# EAGLE board io2 (EAGLE 6.6.0)
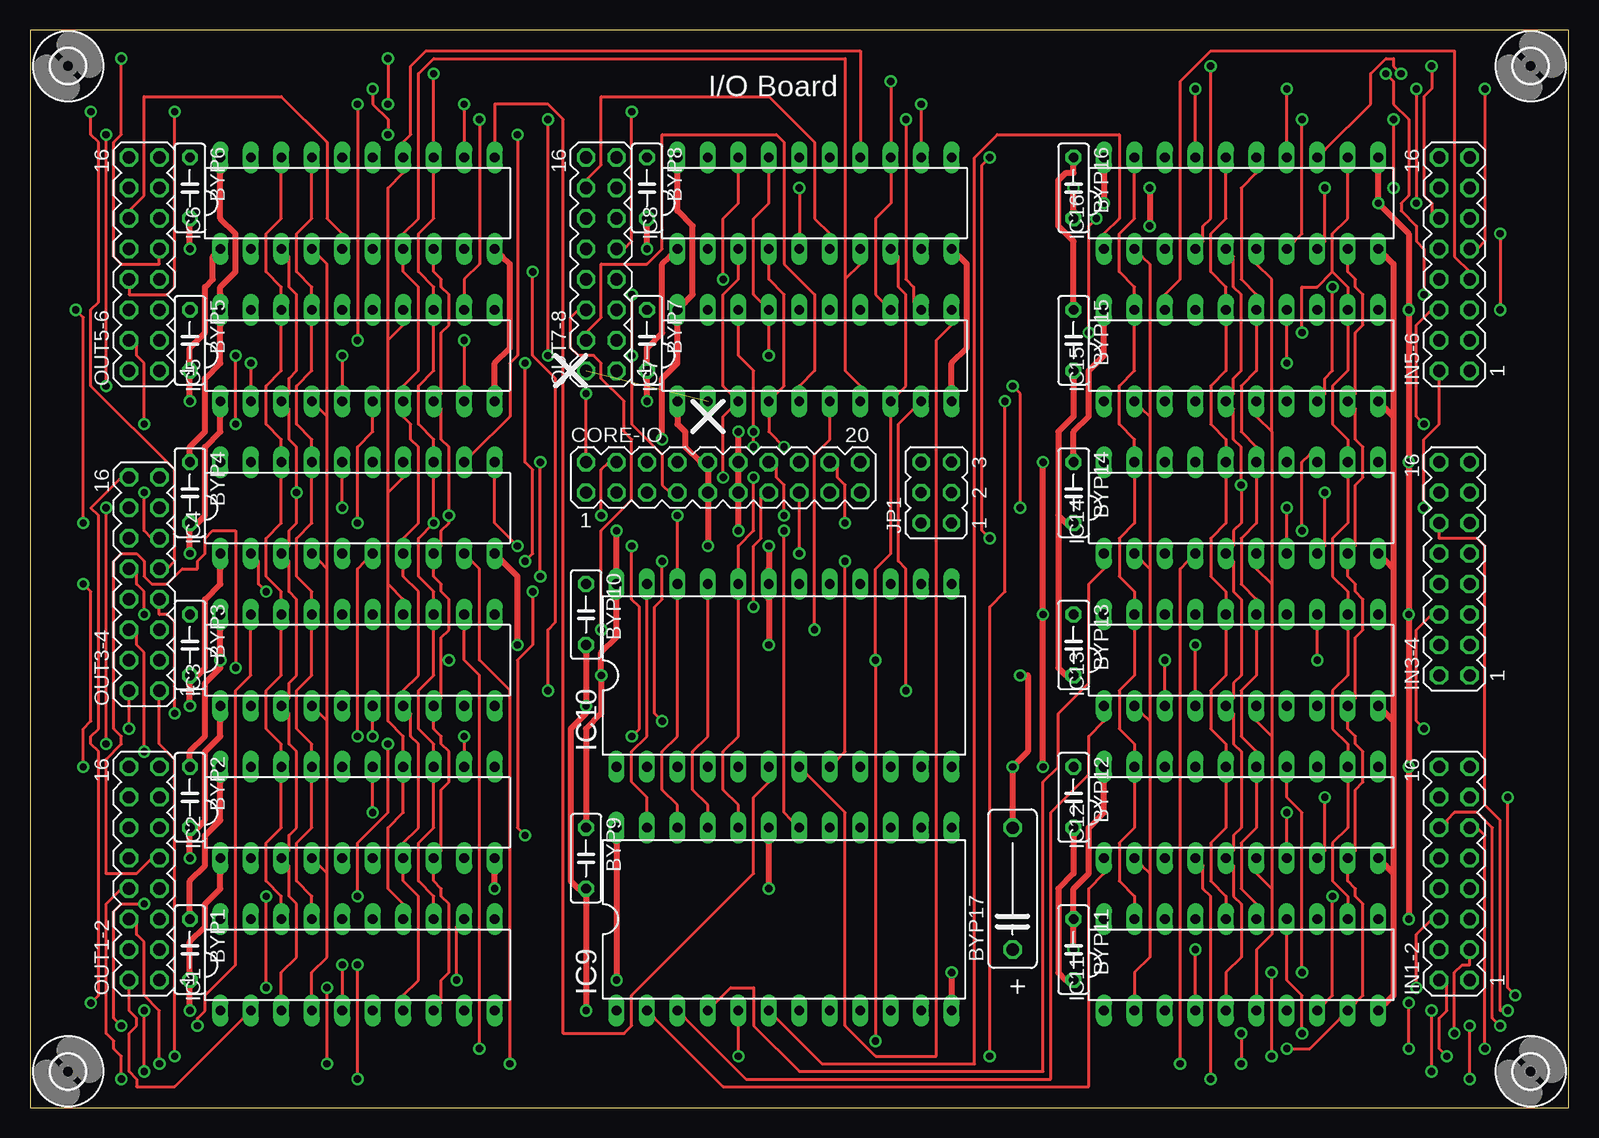
[diagram p2: board, top side]
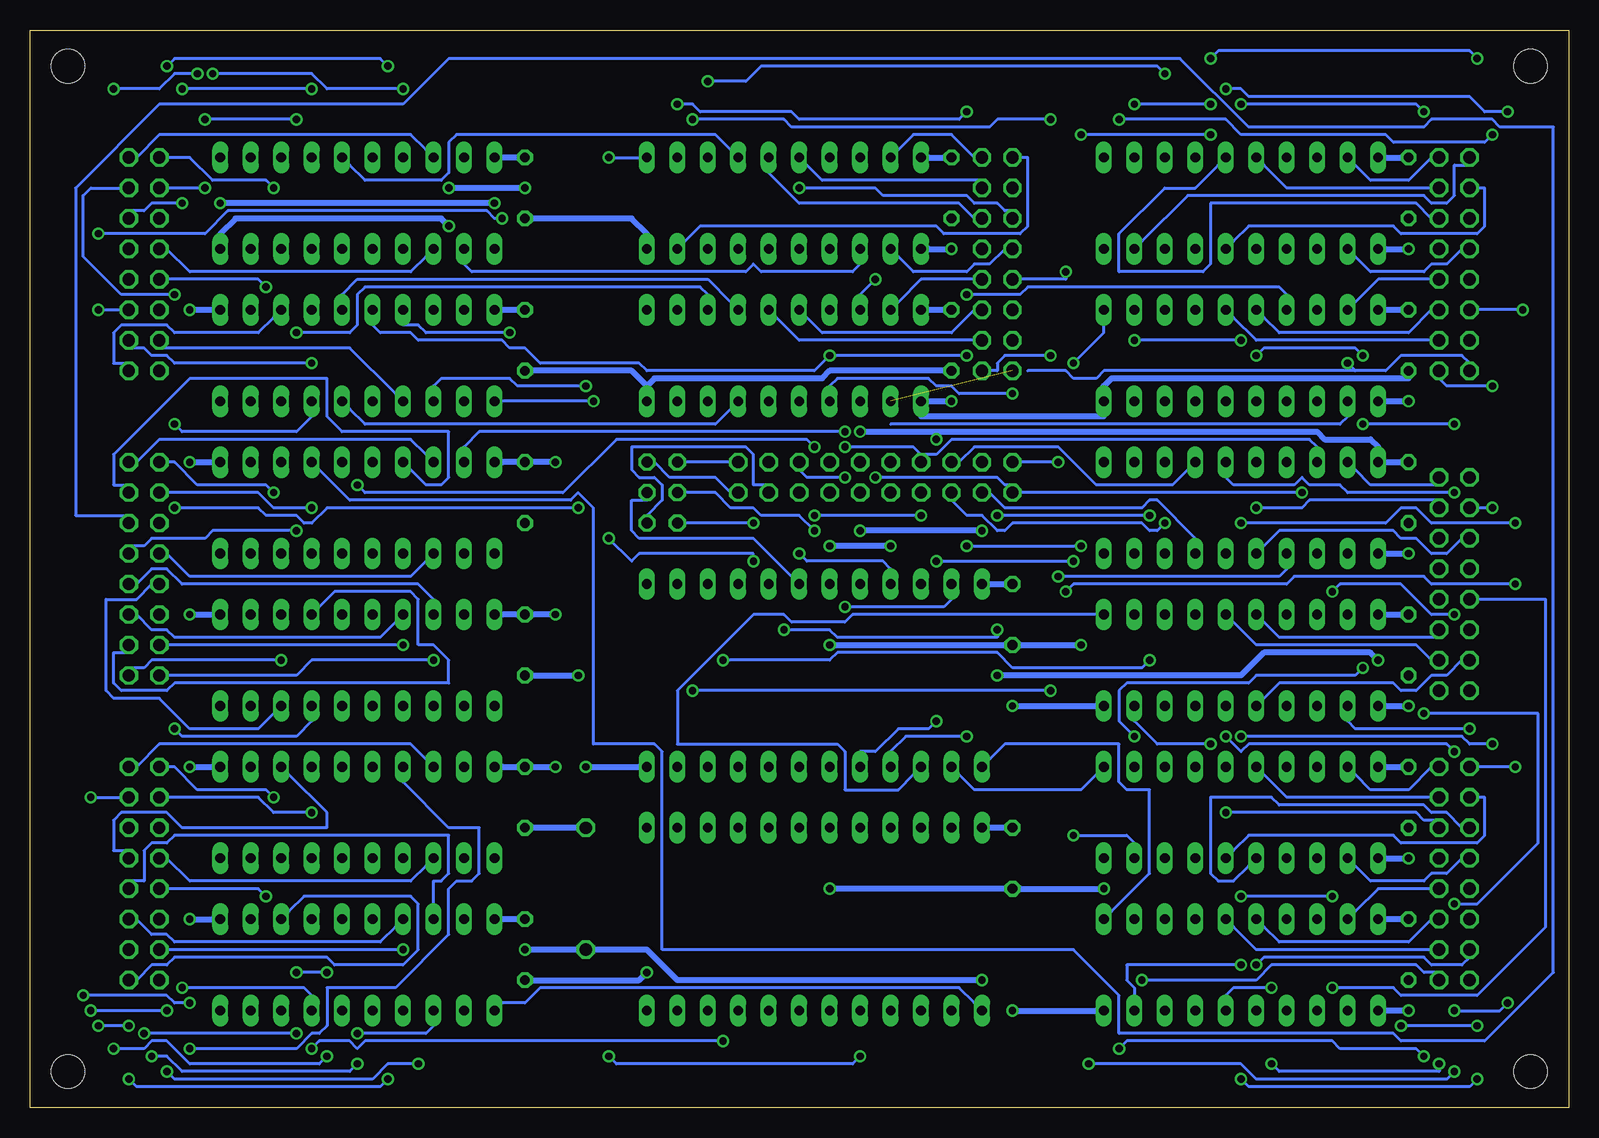
[diagram p3: board, bottom side, seen from below]

Size 128.25 x 89.84 mm. Coordinates in mm from the lower left corner, seen from the top.
Outline: 0,0 128.25,0 128.25,89.84 0,89.84 0,0
Copper layers (1*16): Top 0.035mm / dielectric 1.5mm / Bottom 0.035mm
Design rules "default": minimum track width 10mil, minimum drill 24mil, track to track 8mil, track to pad 8mil, pad to pad 8mil, via to via 8mil, smd to smd 8mil, copper to edge 40mil, drill to drill 8mil, minimum pad ring 10mil, minimum via ring 8mil, stop-mask expansion 4mil, vias tented up to drill 0mil, thermal gap 10mil
Net classes: 1 Power: width 0.508 mm, drill 0.254 mm, clearance 0.254 mm

## Footprints (pad centres in the part's own frame; a part is rotated, then mirrored left to right if it is on the bottom)
C050-025X075 = drill 0.813 octagon: 1 -2.54,0; 2 2.54,0
C102-043X133 = drill 1.016 octagon: 1 -5.08,0; 2 5.08,0
MA10-2 = drill 1.016 octagon: 1 -11.43,-1.27; 2 -11.43,1.27; 3 -8.89,-1.27; 4 -8.89,1.27; 5 -6.35,-1.27; 6 -6.35,1.27; 7 -3.81,-1.27; 8 -3.81,1.27; 9 -1.27,-1.27; 10 -1.27,1.27; 11 1.27,-1.27; 12 1.27,1.27; 13 3.81,-1.27; 14 3.81,1.27; 15 6.35,-1.27; 16 6.35,1.27; 17 8.89,-1.27; 18 8.89,1.27; 19 11.43,-1.27; 20 11.43,1.27
DIL20 = drill 0.813 long: 1 -11.43,-3.81; 2 -8.89,-3.81; 3 -6.35,-3.81; 4 -3.81,-3.81; 5 -1.27,-3.81; 6 1.27,-3.81; 7 3.81,-3.81; 8 6.35,-3.81; 9 8.89,-3.81; 10 11.43,-3.81; 11 11.43,3.81; 12 8.89,3.81; 13 6.35,3.81; 14 3.81,3.81; 15 1.27,3.81; 16 -1.27,3.81; 17 -3.81,3.81; 18 -6.35,3.81; 19 -8.89,3.81; 20 -11.43,3.81
DIL24-6 = drill 0.813 long: 1 -13.97,-7.62; 2 -11.43,-7.62; 3 -8.89,-7.62; 4 -6.35,-7.62; 5 -3.81,-7.62; 6 -1.27,-7.62; 7 1.27,-7.62; 8 3.81,-7.62; 9 6.35,-7.62; 10 8.89,-7.62; 11 11.43,-7.62; 12 13.97,-7.62; 13 13.97,7.62; 14 11.43,7.62; 15 8.89,7.62; 16 6.35,7.62; 17 3.81,7.62; 18 1.27,7.62; 19 -1.27,7.62; 20 -3.81,7.62; 21 -6.35,7.62; 22 -8.89,7.62; 23 -11.43,7.62; 24 -13.97,7.62
MA08-2 = drill 1.016 octagon: 1 -8.89,-1.27; 2 -8.89,1.27; 3 -6.35,-1.27; 4 -6.35,1.27; 5 -3.81,-1.27; 6 -3.81,1.27; 7 -1.27,-1.27; 8 -1.27,1.27; 9 1.27,-1.27; 10 1.27,1.27; 11 3.81,-1.27; 12 3.81,1.27; 13 6.35,-1.27; 14 6.35,1.27; 15 8.89,-1.27; 16 8.89,1.27
JP3Q = drill 0.914 octagon: 1 -2.54,-1.27; 2 -2.54,1.27; 3 0,-1.27; 4 0,1.27; 5 2.54,-1.27; 6 2.54,1.27
2,8 = hole 2.8: 0,0

## Placement (x,y rotation side)
BYP1  .01uf  [C050-025X075]  13.33,13.17 270 top
BYP2  .01uf  [C050-025X075]  13.33,25.87 270 top
BYP3  .01uf  [C050-025X075]  13.33,38.57 270 top
BYP4  .01uf  [C050-025X075]  13.33,51.27 270 top
BYP5  .01uf  [C050-025X075]  13.33,63.97 270 top
BYP6  .01uf  [C050-025X075]  13.33,76.67 270 top
BYP7  .01uf  [C050-025X075]  51.43,63.97 270 top
BYP8  .01uf  [C050-025X075]  51.43,76.67 270 top
BYP9  .01uf  [C050-025X075]  46.35,20.79 270 top
BYP10  .01uf  [C050-025X075]  46.35,41.11 270 top
BYP11  .01uf  [C050-025X075]  86.99,13.17 270 top
BYP12  .01uf  [C050-025X075]  86.99,25.87 270 top
BYP13  .01uf  [C050-025X075]  86.99,38.57 270 top
BYP14  .01uf  [C050-025X075]  86.99,51.27 270 top
BYP15  .01uf  [C050-025X075]  86.99,63.97 270 top
BYP16  .01uf  [C050-025X075]  86.99,76.67 270 top
BYP17  100uf 25V  [C102-043X133]  81.91,18.25 90 top
CORE-IO  [MA10-2]  57.78,52.54 0 top
IC1  74LS374N  [DIL20]  27.3,11.9 0 top
IC2  74LS374N  [DIL20]  27.3,24.6 0 top
IC3  74LS374N  [DIL20]  27.3,37.3 0 top
IC4  74LS374N  [DIL20]  27.3,50 0 top
IC5  74LS374N  [DIL20]  27.3,62.7 0 top
IC6  74LS374N  [DIL20]  27.3,75.4 0 top
IC7  74LS374N  [DIL20]  65.4,62.7 0 top
IC8  74LS374N  [DIL20]  65.4,75.4 0 top
IC9  74154N  [DIL24-6]  62.86,15.71 0 top
IC10  74154N  [DIL24-6]  62.86,36.03 0 top
IC11  74LS373N  [DIL20]  100.96,11.9 0 top
IC12  74LS373N  [DIL20]  100.96,24.6 0 top
IC13  74LS373N  [DIL20]  100.96,37.3 0 top
IC14  74LS373N  [DIL20]  100.96,50 0 top
IC15  74LS373N  [DIL20]  100.96,62.7 0 top
IC16  74LS373N  [DIL20]  100.96,75.4 0 top
IN1-2  [MA08-2]  118.74,19.52 90 top
IN3-4  [MA08-2]  118.74,44.92 90 top
IN5-6  [MA08-2]  118.74,70.32 90 top
JP1  [JP3Q]  75.56,51.27 90 top
OUT1-2  [MA08-2]  9.52,19.52 90 top
OUT3-4  [MA08-2]  9.52,43.65 90 top
OUT5-6  [MA08-2]  9.52,70.32 90 top
OUT7-8  [MA08-2]  47.62,70.32 90 top
U$1  [2,8]  125.09,3.01 0 top
U$2  [2,8]  125.09,86.83 0 top
U$3  [2,8]  3.17,86.83 0 top
U$4  [2,8]  3.17,3.01 0 top

## Tracks (layer width: path | path; a pad name or v marks a point on that pad's centre or on a via)
GND  (via drill 0.61)
  Top 0.508: 113.66,19.52 113.66,9.36 113.02,8.73 IC11.10 | 113.66,19.52 113.02,20.15 IC12.10 | 113.66,32.22 113.02,32.85 IC13.10 | 113.66,32.22 113.66,19.52 | 113.66,44.92 113.02,45.55 IC14.10 | 113.66,44.92 113.66,32.22 | 113.66,57.62 113.02,58.25 IC15.10 | 113.66,57.62 113.66,44.92 | 113.66,57.62 113.66,70.32 113.02,70.95 IC16.10 | 85.72,49.37 86.35,48.73 BYP14.2 | 85.72,49.37 85.72,56.35 86.99,57.62 86.99,60.8 BYP15.2 | IC8.10 77.46,70.95 78.1,70.32 78.1,63.34 76.83,62.06 76.83,60.16 IC7.10 | v76.83,11.27 76.83,9.36 IC9.12 | BYP17.2 81.91,23.96 v81.91,28.41 83.18,29.68 83.18,36.03 v82.55,36.03 | BYP11.2 86.35,10.63 85.72,11.27 85.72,18.25 86.99,19.52 86.99,22.7 BYP12.2 | 85.72,49.37 85.72,36.66 86.35,36.03 BYP13.2 | v93.34,76.67 v93.34,73.5 | v86.99,76.67 86.99,74.77 BYP16.2 | v13.33,8.09 13.33,10 BYP1.2 13.33,11.27 13.33,13.81 14.6,15.08 14.6,16.98 15.87,18.25 15.87,19.52 IC2.1 | v13.33,20.79 13.33,22.7 BYP2.2 13.97,23.33 14.6,23.96 14.6,29.68 15.87,30.95 15.87,32.22 IC3.1 | v13.33,71.59 13.33,73.5 BYP6.2 | v13.33,58.89 13.33,60.8 BYP5.2 13.33,62.06 13.33,63.34 14.6,64.61 14.6,68.41 15.24,69.05 15.24,70.95 IC6.1 | v13.33,33.49 13.33,35.39 BYP3.2 13.97,36.03 14.6,36.66 14.6,42.38 15.87,43.65 15.87,44.92 IC4.1 | v13.33,46.19 13.33,48.09 BYP4.2 13.97,48.73 14.6,49.37 14.6,55.08 15.87,56.35 15.87,57.62 IC5.1 | v46.35,8.09 46.35,17.61 BYP9.2 45.72,18.25 45.08,18.88 45.08,31.58 46.35,32.85 v46.35,33.49 46.35,37.94 BYP10.2 | v38.73,18.25 38.73,19.52 IC2.10 | v61.59,18.25 61.59,22.06 IC9.19 | v40.64,38.57 40.64,44.28 39.37,45.55 IC4.10 | v61.59,38.57 61.59,42.38 IC10.19 61.59,44.92 v61.59,46.82
  Top 0.508: v51.43,71.59 51.43,73.5 BYP8.2 | IC6.10 39.37,70.95 40,70.32 40,63.34 38.73,62.06 38.73,60.16 IC5.10 | v51.43,58.89 51.43,60.8 BYP7.2 51.43,62.06 51.43,63.34 52.7,64.61 52.7,70.32 53.34,70.95 IC8.1 | IC7.1 53.97,57.62 53.97,56.98 54.61,56.35 54.61,55.08 55.88,53.81 CORE-IO.10 56.51,53.17 56.51,51.91 CORE-IO.9 56.51,50.63 v56.51,46.82
  Bottom 0.508: IC8.10 76.83,72.86 78.1,74.13 86.35,74.13 BYP16.2 | 76.83,60.16 78.1,61.43 86.35,61.43 BYP15.2 | 76.83,60.16 IC7.10 76.83,60.16 | v76.83,11.27 77.46,10.63 86.35,10.63 BYP11.2 | v81.91,28.41 77.46,28.41 IC10.12 | BYP12.2 86.35,23.33 82.55,23.33 BYP17.2 | v82.55,36.03 86.35,36.03 BYP13.2 | v93.34,73.5 93.97,74.13 111.12,74.13 112.39,72.86 IC16.10 | v86.99,76.67 v93.34,76.67 | v13.33,8.09 15.24,8.09 IC1.1 | v13.33,20.79 15.24,20.79 IC2.1 | v13.33,71.59 15.24,71.59 IC6.1 | v13.33,58.89 15.24,58.89 IC5.1 | v13.33,33.49 15.24,33.49 IC3.1 | v13.33,46.19 15.24,46.19 IC4.1 | v46.35,8.09 39.37,8.09 IC1.10 | v38.73,18.25 45.72,18.25 BYP9.2 46.98,18.25 v61.59,18.25 | v46.35,33.49 39.37,33.49 IC3.10 | v40.64,38.57 45.72,38.57 BYP10.2 46.98,38.57 v61.59,38.57 | v51.43,71.59 53.34,71.59 IC8.1 | v51.43,58.89 53.34,58.89 IC7.1 53.97,57.62 38.73,57.62 IC5.10 38.73,60.16 38.1,60.8 13.33,60.8 BYP5.2 | v56.51,46.82 v61.59,46.82 | 76.83,60.16 76.19,60.8 62.23,60.8 61.59,61.43 52.07,61.43 BYP7.2
IN00
  Bottom 0.254: IC9.1 49.53,8.73 50.8,10 85.72,10 86.99,8.73 88.89,8.73 IC11.1
IN01
  Top 0.254: IC9.2 52.07,7.46 57.78,1.74 88.26,1.74 88.26,18.25 89.53,19.52 IC12.1
IN02
  Top 0.254: IC9.3 54.61,7.46 59.69,2.38 85.08,2.38 85.08,24.6 88.26,27.77 88.26,30.95 89.53,32.22 IC13.1
IN03
  Top 0.254: IC9.4 57.15,8.73 58.41,10 60.32,10 60.32,6.82 64.13,3.01 84.45,3.01 84.45,27.14 85.72,28.41 85.72,32.85 88.26,35.39 88.26,43.65 89.53,44.92 IC14.1
IN04  (via drill 0.61)
  Top 0.254: v59.05,4.28 59.05,6.82 IC9.5 | v80,4.28 80,41.74 81.27,43.02 v81.27,58.89
  Bottom 0.254: v59.05,4.28 59.69,3.64 79.37,3.64 v80,4.28 | v81.27,58.89 88.89,58.89 IC15.1
IN05
  Top 0.254: IC9.6 62.23,7.46 66.03,3.64 78.73,3.64 78.73,79.21 80.64,81.11 90.8,81.11 90.8,74.13 89.53,72.86 IC16.1
ISEL  (via drill 0.61)
  Top 0.254: v62.86,48.09 62.86,24.6 63.5,23.96 IC9.18
  Bottom 0.254: v62.86,48.09 64.13,49.37 67.3,49.37 67.94,50 69.84,50 71.11,51.27 73.66,51.27 JP1.4
N$1
  Bottom 0.254: IC12.3 95.24,20.15 96.52,18.88 114.93,18.88 116.83,20.79 IN1-2.10
N$2  (via drill 0.61)
  Top 0.254: v98.42,2.38 98.42,17.61 97.78,18.25 97.78,20.15 IC12.4 | v120.01,2.38 v120.01,6.82 | v122.55,6.82 121.91,7.46 121.91,23.33 120.64,24.6 118.74,24.6 118.1,23.96 118.1,23.33 IN1-2.12
  Bottom 0.254: v98.42,2.38 99.05,1.74 119.38,1.74 v120.01,2.38 | v120.01,6.82 v122.55,6.82
N$3  (1 unrouted)
N$7  (via drill 0.61)
  Top 0.254: v104.77,24.6 104.77,22.06 IC12.7
  Bottom 0.254: v104.77,24.6 107.94,24.6 109.21,25.87 116.83,25.87 IN1-2.14
N$8  (via drill 0.61)
  Top 0.254: v107.94,25.87 107.94,21.42 IC12.8
  Bottom 0.254: v107.94,25.87 108.58,26.5 114.3,26.5 116.2,28.41 116.83,28.41 IN1-2.16
N$9  (via drill 0.61)
  Top 0.254: v108.58,17.61 108.58,9.36 107.94,8.73 IC11.8
  Bottom 0.254: v108.58,17.61 109.21,18.25 116.83,18.25 IN1-2.8
N$10  (via drill 0.61)
  Top 0.254: v115.56,10 115.56,14.44 116.83,15.71 IN1-2.6
  Bottom 0.254: v115.56,10 105.41,10 104.77,9.36 IC11.7
N$11  (via drill 0.61)
  Top 0.254: v97.15,13.17 97.15,9.36 IC11.4
  Bottom 0.254: v97.15,13.17 116.83,13.17 IN1-2.4
N$12  (via drill 0.61)
  Top 0.254: v100.96,6.18 v100.96,3.64 | v118.1,4.28 117.47,4.92 117.47,7.46 118.1,8.09 118.1,10.63 IN1-2.2
  Bottom 0.254: v100.96,6.18 95.24,6.18 94.61,6.82 IC11.3 | v100.96,3.64 101.59,3.01 115.56,3.01 116.83,4.28 v118.1,4.28
N$13
  Bottom 0.254: IC11.13 106.67,16.34 105.41,17.61 96.52,17.61 95.88,16.98 95.88,13.17 97.15,11.9 102.86,11.9 103.5,12.54 116.2,12.54 116.83,11.9 118.1,11.9 119.38,10.63 IN1-2.1
N$14  (via drill 0.61)
  Top 0.254: v106.04,6.18 106.04,9.36 104.77,10.63 104.77,14.44 IC11.14 | v118.74,6.18 118.74,11.27 119.38,11.9 120.01,11.9 120.01,12.54 IN1-2.3
  Bottom 0.254: v106.04,6.18 v118.74,6.18
N$15
  Bottom 0.254: IC11.17 97.78,15.08 99.05,13.81 116.2,13.81 116.83,14.44 118.1,14.44 119.38,15.71 IN1-2.5
N$16
  Bottom 0.254: IC11.18 94.61,16.98 94.61,18.88 93.97,18.88 93.34,19.52 93.34,22.7 116.2,22.7 116.83,22.06 118.1,22.06 118.74,21.42 118.74,18.88 120.01,18.88 IN1-2.7
N$17
  Bottom 0.254: IC12.13 106.67,27.77 103.5,24.6 103.5,23.33 115.56,23.33 116.83,24.6 120.64,24.6 121.28,23.96 121.28,21.42 120.01,21.42 IN1-2.9
N$18  (via drill 0.61)
  Top 0.254: v121.28,4.92 121.28,22.7 120.64,23.33 IN1-2.11 | v103.5,4.28 v103.5,11.27 | v106.04,11.27 106.04,24.6 104.77,25.87 104.77,27.14 IC12.14
  Bottom 0.254: v121.28,4.92 118.74,4.92 118.1,5.55 116.83,5.55 114.93,3.64 104.13,3.64 v103.5,4.28 | v103.5,11.27 v106.04,11.27
N$19  (via drill 0.61)
  Top 0.254: v123.19,25.87 123.19,10 v123.82,9.36 | v114.93,4.92 v114.93,8.73
  Bottom 0.254: v123.19,25.87 120.64,25.87 IN1-2.13 | v123.82,9.36 116.83,9.36 116.2,8.73 v114.93,8.73 | v114.93,4.92 106.04,4.92 104.77,6.18 104.13,6.18 103.5,6.82 103.5,10 97.78,10 93.34,14.44 93.34,18.25 92.7,18.88 91.44,18.88 90.8,19.52 90.8,23.33 93.34,23.33 97.15,27.14 IC12.17
N$20
  Bottom 0.254: IC12.18 95.24,29.04 96.52,30.31 117.47,30.31 119.38,28.41 IN1-2.15
N$26  (via drill 0.61)
  Top 0.254: v18.41,62.06 IC5.2
  Bottom 0.254: 17.77,61.43 15.24,61.43 13.97,62.7 8.89,62.7 8.25,62.06 OUT5-6.2 | 17.77,61.43 v18.41,62.06 | 56.51,56.98 19.04,56.98 18.41,57.62 IC5.2 | 45.08,61.43 41.91,61.43 41.27,60.8 39.37,60.8 38.73,61.43 17.77,61.43
N$29
  Bottom 0.254: IC14.3 95.24,45.55 96.52,44.28 114.93,44.28 116.83,46.19 IN3-4.10
N$30  (via drill 0.61)
  Top 0.254: v95.88,3.64 95.88,44.92 96.52,45.55 IC14.4 | v116.83,3.01 v116.83,8.09 | v123.19,8.09 122.55,8.09 122.55,23.96 121.28,25.23 121.28,46.82 120.64,47.46 117.47,47.46 117.47,48.09 IN3-4.12
  Bottom 0.254: v95.88,3.64 98.42,3.64 99.69,2.38 116.2,2.38 v116.83,3.01 | v116.83,8.09 v123.19,8.09
N$31  (via drill 0.61)
  Top 0.254: v104.77,50 104.77,47.46 IC14.7
  Bottom 0.254: v104.77,50 107.94,50 109.21,51.27 116.83,51.27 IN3-4.14
N$32  (via drill 0.61)
  Top 0.254: v107.94,51.27 107.94,46.82 IC14.8
  Bottom 0.254: v107.94,51.27 108.58,51.91 114.3,51.91 116.2,53.81 116.83,53.81 IN3-4.16
N$33  (via drill 0.61)
  Top 0.254: v37.46,4.92 37.46,36.03 36.19,37.3 36.19,39.84 IC3.12 | v12.06,4.28 12.06,29.04 10.79,30.31 10.79,34.12 OUT3-4.1
  Bottom 0.254: v37.46,4.92 36.83,5.55 19.68,5.55 19.04,4.92 12.7,4.92 v12.06,4.28
N$34
  Bottom 0.254: IC3.15 27.93,40.48 26.03,38.57 12.7,38.57 11.43,37.3 OUT3-4.3
N$35
  Bottom 0.254: IC3.16 25.39,40.48 24.12,39.2 10.79,39.2 OUT3-4.5
N$36  (via drill 0.61)
  Top 0.254: v13.97,6.82 13.97,7.46 14.6,8.09 14.6,9.36 17.14,11.9 17.14,34.76 18.41,36.03 18.41,39.84 IC3.19 | v7.62,6.82 6.98,7.46 6.98,16.34 7.62,16.98 v9.52,16.98 | v12.06,32.85 12.06,40.48 11.43,41.11 10.79,41.11 10.79,41.74 OUT3-4.7
  Bottom 0.254: v7.62,6.82 v13.97,6.82 | v9.52,16.98 7.62,16.98 2.54,22.06 2.54,32.85 v12.06,32.85
N$37  (via drill 0.61)
  Top 0.254: v94.61,37.3 94.61,34.76 IC13.3
  Bottom 0.254: v94.61,37.3 104.77,37.3 106.04,36.03 116.83,36.03 IN3-4.2
N$38  (via drill 0.61)
  Top 0.254: v97.15,38.57 97.15,34.76 IC13.4
  Bottom 0.254: v97.15,38.57 116.83,38.57 IN3-4.4
N$39  (via drill 0.61)
  Top 0.254: v116.2,31.58 115.56,32.22 115.56,39.84 116.83,41.11 IN3-4.6
  Bottom 0.254: v116.2,31.58 115.56,30.95 106.04,30.95 104.77,32.22 IC13.7
N$40
  Bottom 0.254: IC13.8 107.94,32.85 109.21,31.58 114.93,31.58 117.47,34.12 121.28,34.12 121.91,34.76 121.91,42.38 119.38,42.38 118.1,43.65 IN3-4.8
N$41  (via drill 0.61)
  Top 0.254: v106.04,48.09 106.04,53.81 106.67,54.45 IC14.13
  Bottom 0.254: v106.04,48.09 113.02,48.09 113.66,47.46 118.1,47.46 118.74,46.82 120.01,46.82 IN3-4.9
N$42
  Bottom 0.254: IC14.14 104.13,53.17 101.59,50.63 83.18,50.63 82.55,51.27 81.27,50 81.27,30.31 76.19,30.31 75.56,29.68 75.56,13.17 41.27,13.17 37.46,9.36 37.46,6.18 14.6,6.18 13.97,5.55 6.98,5.55 1.27,11.27 1.27,81.75 5.71,81.75 6.34,82.39 11.43,82.39 12.06,81.75 26.66,81.75 32.38,87.47 93.34,87.47 97.15,83.66 117.47,83.66 124.45,76.67 124.45,49.37 120.01,49.37 IN3-4.11
N$43
  Bottom 0.254: IC14.17 96.52,53.17 95.24,51.91 93.97,51.91 93.34,52.54 93.34,56.35 102.23,56.35 103.5,57.62 103.5,60.8 114.93,60.8 121.28,54.45 121.28,51.91 120.01,51.91 IN3-4.13
N$44
  Bottom 0.254: IC14.18 95.24,54.45 96.52,55.71 117.47,55.71 119.38,53.81 IN3-4.15
N$45  (via drill 0.61)
  Top 0.254: v107.31,37.3 107.31,39.84 IC13.13
  Bottom 0.254: v107.31,37.3 118.1,37.3 118.74,36.66 120.01,36.66 IN3-4.1
N$46
  Bottom 0.254: IC13.14 104.13,41.74 102.86,43.02 96.52,43.02 95.88,42.38 95.88,38.57 94.61,38.57 93.34,37.3 93.34,35.39 116.2,35.39 116.83,34.76 120.64,34.76 121.28,35.39 121.28,37.94 120.01,37.94 IN3-4.3
N$47
  Bottom 0.254: IC13.17 97.78,40.48 99.05,39.2 116.2,39.2 116.83,39.84 118.1,39.84 119.38,41.11 IN3-4.5
N$48
  Bottom 0.254: IC13.18 94.61,42.38 95.88,43.65 115.56,43.65 116.83,44.92 118.1,44.92 119.38,43.65 IN3-4.7
N$49
  Bottom 0.254: IC3.5 25.39,34.12 24.12,35.39 14.6,35.39 13.97,34.76 12.7,34.76 11.43,36.03 10.16,36.03 8.89,37.3 OUT3-4.4
N$50  (via drill 0.61)
  Top 0.254: v28.57,30.95 28.57,32.22 IC3.6 | v9.52,29.68 9.52,37.94 8.89,38.57 8.89,39.84 OUT3-4.6
  Bottom 0.254: v28.57,30.95 27.3,29.68 26.66,30.31 10.16,30.31 v9.52,29.68
N$51  (via drill 0.61)
  Top 0.254: v8.25,31.58 8.25,34.12 OUT3-4.2
  Bottom 0.254: v8.25,31.58 17.77,31.58 18.41,32.22 IC3.2
N$52  (via drill 0.61)
  Top 0.254: v29.84,30.31 29.84,24.6 27.3,22.06 v27.3,17.61 | v19.68,10 v19.68,17.61
  Bottom 0.254: v29.84,30.31 34.29,30.31 36.19,32.22 IC3.9 | v19.68,17.61 v27.3,17.61 | v19.68,10 14.6,10 13.97,9.36 7.62,9.36 1.9,15.08 1.9,42.38 7.62,42.38 OUT3-4.8
N$53  (via drill 0.61)
  Top 0.254: v35.55,10.63 35.55,15.08 IC1.12
  Bottom 0.254: v35.55,10.63 26.03,10.63 24.76,11.9 12.7,11.9 12.06,11.27 10.79,11.27 OUT1-2.1
N$54
  Bottom 0.254: IC1.15 27.93,15.08 26.03,13.17 11.43,13.17 OUT1-2.3
N$55
  Bottom 0.254: IC1.16 25.39,15.08 24.12,13.81 13.33,13.81 11.43,15.71 OUT1-2.5
N$56
  Bottom 0.254: IC1.19 17.77,16.34 15.87,18.25 11.43,18.25 OUT1-2.7
N$57
  Top 0.254: IC1.2 17.77,7.46 12.06,1.74 8.89,1.74 8.89,2.38 8.25,3.01 8.25,6.18 8.89,6.82 8.89,7.46 8.25,8.09 8.25,10 OUT1-2.2
N$58  (via drill 0.61)
  Top 0.254: v26.03,11.9 26.03,9.36 IC1.5
  Bottom 0.254: v26.03,11.9 25.39,12.54 12.06,12.54 11.43,11.9 8.89,11.9 8.25,12.54 OUT1-2.4
N$59  (via drill 0.61)
  Top 0.254: v10.79,3.64 10.79,8.09 9.52,9.36 9.52,13.81 8.89,14.44 8.89,15.71 OUT1-2.6 | v24.76,3.64 v24.76,10
  Bottom 0.254: v10.79,3.64 10.79,3.01 24.12,3.01 v24.76,3.64 | v24.76,10 27.93,10 28.57,9.36 IC1.6
N$60  (via drill 0.61)
  Top 0.254: v27.3,2.38 v27.3,11.9 | v7.62,2.38 7.62,4.28 6.98,4.92 6.98,5.55 6.34,6.18 6.34,16.98 7.62,18.25 OUT1-2.8
  Bottom 0.254: v27.3,11.9 36.83,11.9 36.83,10.63 36.19,10 36.19,9.36 IC1.9 | v27.3,2.38 26.66,1.74 8.25,1.74 v7.62,2.38
N$61
  Bottom 0.254: IC2.19 17.77,27.77 16.5,26.5 13.33,26.5 11.43,28.41 OUT1-2.15
N$62
  Bottom 0.254: IC2.16 25.39,27.77 23.49,25.87 11.43,25.87 OUT1-2.13
N$63  (via drill 0.61)
  Top 0.254: v28.57,24.6 28.57,27.14 IC2.15
  Bottom 0.254: v28.57,24.6 12.7,24.6 12.06,23.96 10.79,23.96 OUT1-2.11
N$64  (via drill 0.61)
  Top 0.254: v17.14,36.66 17.14,48.09 15.24,48.09 14.6,47.46 14.6,46.19 13.97,45.55 13.97,44.92 12.7,44.92 11.43,43.65 10.16,43.65 9.52,44.28 9.52,45.55 8.89,46.19 7.62,46.19 6.98,45.55 6.98,31.58 7.62,30.95 7.62,30.31 6.34,29.04 6.34,19.52 8.89,19.52 10.16,20.79 OUT1-2.9 | v36.19,30.95 36.19,29.68 IC2.12
  Bottom 0.254: v17.14,36.66 17.77,36.03 26.03,36.03 26.66,35.39 36.83,35.39 37.46,34.76 37.46,32.22 v36.19,30.95
N$65
  Bottom 0.254: IC2.2 17.77,20.15 16.5,18.88 12.06,18.88 11.43,19.52 10.16,19.52 8.89,20.79 OUT1-2.10
N$66
  Bottom 0.254: IC2.5 26.66,20.15 27.93,18.88 29.2,18.88 29.84,19.52 29.84,25.87 24.76,25.87 24.12,25.23 12.06,25.23 11.43,24.6 10.16,24.6 8.89,23.33 OUT1-2.12
N$67
  Bottom 0.254: IC2.6 27.93,21.42 26.66,22.7 14.6,22.7 13.97,22.06 7.62,22.06 6.98,22.7 6.98,25.87 7.62,25.87 OUT1-2.14
N$68  (via drill 0.61)
  Top 0.254: v41.27,22.7 40.64,23.33 40.64,37.3 41.91,38.57 v41.91,43.02 | v4.44,43.65 5.08,43.02 5.08,32.22 4.44,31.58 v4.44,28.41
  Bottom 0.254: v41.27,22.7 36.83,22.7 36.19,22.06 IC2.9 | v41.91,43.02 41.27,43.65 23.49,43.65 22.86,44.28 12.06,44.28 11.43,43.65 v4.44,43.65 | v4.44,28.41 7.62,28.41 OUT1-2.16
N$69  (via drill 0.61)
  Top 0.254: v9.52,41.11 9.52,43.02 8.89,43.65 8.89,44.92 OUT3-4.10 | v19.68,43.02 19.04,43.65 19.04,45.55 IC4.2
  Bottom 0.254: v9.52,41.11 11.43,41.11 13.97,43.65 19.04,43.65 v19.68,43.02
N$70
  Bottom 0.254: IC4.5 25.39,46.82 24.12,48.09 14.6,48.09 13.97,47.46 12.7,47.46 11.43,46.19 10.16,46.19 8.89,47.46 OUT3-4.12
N$71  (via drill 0.61)
  Top 0.254: v27.3,30.95 27.3,44.92 27.93,45.55 IC4.6 | v6.34,30.31 v6.34,50
  Bottom 0.254: v27.3,30.95 8.89,30.95 8.25,30.31 v6.34,30.31 | v6.34,50 7.62,50 OUT3-4.14
N$72  (via drill 0.61)
  Top 0.254: v40,3.64 40,34.76 37.46,37.3 37.46,44.92 36.83,45.55 IC4.9 | v9.52,3.01 v9.52,8.09 | v5.08,8.73 5.71,9.36 5.71,29.68 5.08,30.31 5.08,30.95 5.71,31.58 5.71,49.37 5.08,50 7.62,52.54 OUT3-4.16
  Bottom 0.254: v40,3.64 27.3,3.64 26.03,2.38 10.16,2.38 v9.52,3.01 | v9.52,8.09 5.71,8.09 v5.08,8.73
N$73
  Bottom 0.254: IC4.19 17.77,53.17 16.5,51.91 10.79,51.91 OUT3-4.15
N$74  (via drill 0.61)
  Top 0.254: v26.03,50 26.03,52.54 IC4.16
  Bottom 0.254: v26.03,50 22.22,50 21.58,50.63 10.79,50.63 OUT3-4.13
N$75  (via drill 0.61)
  Top 0.254: v9.52,51.27 9.52,48.09 10.16,47.46 OUT3-4.11
  Bottom 0.254: v9.52,51.27 18.41,51.27 19.04,51.91 21.58,51.91 22.22,52.54 22.86,51.91 27.93,51.91 28.57,52.54 IC4.15
N$76  (via drill 0.61)
  Top 0.254: v40.64,81.11 40.64,62.7 40,62.06 40,57.62 36.83,54.45 IC4.12 | v29.84,81.11 29.84,82.39 28.57,83.66 v28.57,84.92 | v5.08,83.02 5.08,81.11 5.71,80.48 5.71,67.14 5.08,66.51 5.08,60.16 12.06,53.17 12.06,45.55 11.43,44.92 OUT3-4.9
  Bottom 0.254: v29.84,81.11 v40.64,81.11 | v28.57,84.92 27.3,84.92 26.66,84.29 8.25,84.29 6.98,83.02 v5.08,83.02
N$77
  Bottom 0.254: IC16.3 95.24,70.95 96.52,69.69 114.93,69.69 116.83,71.59 IN5-6.10
N$78  (via drill 0.61)
  Top 0.254: v98.42,86.83 98.42,74.13 97.78,73.5 97.78,72.22 IC16.4 | v116.83,86.83 116.83,84.92 116.2,84.29 116.2,76.03 116.83,75.4 116.83,74.13 IN5-6.12
  Bottom 0.254: v98.42,86.83 99.05,87.47 116.2,87.47 v116.83,86.83
N$79  (via drill 0.61)
  Top 0.254: v106.04,82.39 106.04,72.86 105.41,72.22 IC16.7 | v113.66,82.39 v113.66,76.67
  Bottom 0.254: v106.04,82.39 v113.66,82.39 | v113.66,76.67 116.83,76.67 IN5-6.14
N$80  (via drill 0.61)
  Top 0.254: v107.94,76.67 107.94,72.22 IC16.8
  Bottom 0.254: v107.94,76.67 108.58,77.3 113.02,77.3 114.93,79.21 116.83,79.21 IN5-6.16
N$81  (via drill 0.61)
  Top 0.254: v6.34,60.16 v6.34,81.11 | v37.46,82.39 37.46,70.32 36.19,69.05 36.19,67.78 IC5.12
  Bottom 0.254: v6.34,60.16 10.16,60.16 10.79,60.8 OUT5-6.1 | v6.34,81.11 6.98,80.48 14.6,80.48 15.24,81.11 27.3,81.11 28.57,82.39 v37.46,82.39
N$82
  Bottom 0.254: IC5.15 27.93,65.88 26.03,63.97 11.43,63.97 OUT5-6.3
N$83
  Bottom 0.254: IC5.16 25.39,65.88 24.12,64.61 13.33,64.61 11.43,66.51 OUT5-6.5
N$84
  Bottom 0.254: IC5.19 17.77,67.14 15.87,69.05 11.43,69.05 OUT5-6.7
N$85  (via drill 0.61)
  Top 0.254: v73.02,82.39 73.02,69.05 73.66,68.41 73.66,67.14 IC7.12 | v43.18,62.7 v43.18,82.39
  Bottom 0.254: v73.02,82.39 65.4,82.39 64.77,81.75 48.26,81.75 47.62,82.39 v43.18,82.39 | v43.18,62.7 46.98,62.7 47.62,62.06 47.62,61.43 48.26,61.43 OUT7-8.1
N$86
  Bottom 0.254: IC7.15 66.03,65.88 64.13,63.97 49.53,63.97 OUT7-8.3
N$87
  Bottom 0.254: IC7.16 63.5,65.88 62.23,64.61 51.43,64.61 49.53,66.51 OUT7-8.5
N$88
  Bottom 0.254: IC7.19 55.88,67.14 53.97,69.05 49.53,69.05 OUT7-8.7
N$89  (via drill 0.61)
  Top 0.254: v26.03,62.7 26.03,60.16 IC5.5 | v17.14,56.98 v17.14,62.7 | v9.52,56.98 9.52,62.06 8.89,62.7 8.89,63.97 OUT5-6.4
  Bottom 0.254: v26.03,62.7 25.39,63.34 17.77,63.34 v17.14,62.7 | v9.52,56.98 v17.14,56.98
N$90  (via drill 0.61)
  Top 0.254: v3.8,66.51 4.44,65.88 v4.44,48.73 | v27.3,48.73 27.3,55.08 28.57,56.35 28.57,57.62 IC5.6
  Bottom 0.254: v3.8,66.51 7.62,66.51 OUT5-6.6 | v4.44,48.73 11.43,48.73 12.7,50 13.97,50 15.24,48.73 v27.3,48.73
N$91  (via drill 0.61)
  Top 0.254: v36.19,63.97 36.19,60.16 IC5.9 | v27.3,83.66 v27.3,63.97 | v12.06,83.02 12.06,68.41 11.43,67.78 8.25,67.78 8.25,68.41 OUT5-6.8
  Bottom 0.254: v27.3,63.97 v36.19,63.97 | v27.3,83.66 12.7,83.66 v12.06,83.02
N$92  (via drill 0.61)
  Top 0.254: v36.19,83.66 36.19,80.48 IC6.12 | v29.84,87.47 v29.84,83.66 | v7.62,87.47 7.62,81.11 6.98,80.48 6.98,70.95 7.62,70.32 10.79,70.32 10.79,70.95 OUT5-6.9
  Bottom 0.254: v29.84,83.66 v36.19,83.66 | v29.84,87.47 29.2,88.1 8.25,88.1 v7.62,87.47
N$93
  Bottom 0.254: IC6.15 29.2,78.58 31.11,76.67 33.65,76.67 37.46,72.86 37.46,69.69 30.47,69.69 29.84,70.32 29.84,75.4 12.7,75.4 11.43,74.13 OUT5-6.11
N$95
  Bottom 0.254: IC6.16 25.39,78.58 23.49,76.67 11.43,76.67 OUT5-6.13
N$96
  Bottom 0.254: IC6.19 17.77,78.58 16.5,77.3 13.33,77.3 11.43,79.21 OUT5-6.15
N$97
  Bottom 0.254: IC6.2 17.77,70.95 16.5,69.69 12.06,69.69 11.43,70.32 10.16,70.32 8.89,71.59 OUT5-6.10
N$98
  Top 0.254: IC6.5 26.03,72.86 24.76,74.13 24.76,80.48 20.95,84.29 9.52,84.29 9.52,76.03 8.25,74.77 OUT5-6.12
N$99
  Bottom 0.254: IC6.6 27.93,72.22 26.66,73.5 14.6,73.5 13.97,72.86 7.62,72.86 6.98,73.5 6.98,76.67 7.62,76.67 OUT5-6.14
N$100
  Bottom 0.254: IC6.9 35.55,72.22 31.74,76.03 12.06,76.03 11.43,75.4 10.16,75.4 9.52,76.03 9.52,78.58 8.25,78.58 OUT5-6.16
N$101  (via drill 0.61)
  Top 0.254: v81.91,60.16 82.55,59.52 v82.55,50 | v116.2,50 116.2,55.71 117.47,56.98 117.47,60.8 IN5-6.2
  Bottom 0.254: v81.91,60.16 87.62,60.16 88.26,60.8 93.97,60.8 94.61,60.16 IC15.3 | v82.55,50 103.5,50 104.77,48.73 105.41,48.73 106.04,49.37 108.58,49.37 109.21,50 v116.2,50
N$102
  Bottom 0.254: IC15.4 97.78,59.52 101.59,63.34 117.47,63.34 IN5-6.4
N$103  (via drill 0.61)
  Top 0.254: v116.2,56.98 115.56,57.62 115.56,65.24 116.83,66.51 IN5-6.6
  Bottom 0.254: v116.2,56.98 115.56,56.35 106.04,56.35 104.77,57.62 IC15.7
N$104  (via drill 0.61)
  Top 0.254: v108.58,68.41 108.58,61.43 107.94,60.8 107.94,59.52 IC15.8
  Bottom 0.254: v108.58,68.41 109.21,69.05 116.83,69.05 IN5-6.8
N$105  (via drill 0.61)
  Top 0.254: v114.3,86.19 113.66,86.83 113.66,87.47 113.02,87.47 111.75,86.19 111.75,83.66 107.94,79.84 IC16.13 | v121.28,84.92 121.28,72.22 120.64,71.59 IN5-6.9
  Bottom 0.254: v114.3,86.19 116.2,86.19 117.47,84.92 v121.28,84.92
N$106  (via drill 0.61)
  Top 0.254: v104.77,84.92 104.77,80.48 IC16.14 | v115.56,84.92 v115.56,75.4
  Bottom 0.254: v104.77,84.92 v115.56,84.92 | v115.56,75.4 118.1,75.4 118.74,74.77 120.01,74.77 IN5-6.11
N$107  (via drill 0.61)
  Top 0.254: v97.15,84.92 97.15,80.48 IC16.17 | v113.02,86.19 113.66,85.56 113.66,83.66 114.93,82.39 114.93,76.03 114.3,75.4 114.3,74.77 115.56,73.5 115.56,72.22 116.2,71.59 v116.2,67.78
  Bottom 0.254: v97.15,84.92 103.5,84.92 104.77,86.19 v113.02,86.19 | v116.2,67.78 120.64,67.78 123.82,70.95 123.82,76.03 123.19,76.67 120.64,76.67 IN5-6.13
N$108
  Bottom 0.254: IC16.18 95.24,79.84 96.52,81.11 117.47,81.11 119.38,79.21 IN5-6.15
N$109
  Bottom 0.254: IC15.13 107.94,65.88 109.21,64.61 116.2,64.61 116.83,65.24 120.64,65.24 121.28,64.61 121.28,62.06 120.01,62.06 IN5-6.1
N$110  (via drill 0.61)
  Top 0.254: v104.77,62.06 104.77,65.24 IC15.14
  Bottom 0.254: v104.77,62.06 116.2,62.06 116.83,62.7 118.1,62.7 118.74,63.34 120.01,63.34 IN5-6.3
N$111  (via drill 0.61)
  Top 0.254: v88.26,64.61 88.26,73.5 v88.89,74.13 | v122.55,72.86 v122.55,66.51
  Bottom 0.254: v88.26,64.61 95.24,64.61 95.88,65.24 97.15,65.24 IC15.17 | v88.89,74.13 89.53,74.13 90.16,74.77 111.75,74.77 113.66,72.86 v122.55,72.86 | v122.55,66.51 120.64,66.51 IN5-6.5
N$112
  Top 0.254: IC15.18 94.61,67.78 95.88,69.05 95.88,85.56 98.42,88.1 118.74,88.1 118.74,70.95 120.01,69.69 IN5-6.7
N$113
  Bottom 0.254: IC8.19 55.88,79.84 54.61,81.11 51.43,81.11 49.53,79.21 OUT7-8.15
N$114
  Bottom 0.254: IC8.16 63.5,78.58 62.23,77.3 48.89,77.3 OUT7-8.13
N$115
  Bottom 0.254: IC8.15 66.67,77.94 64.13,75.4 50.8,75.4 49.53,74.13 OUT7-8.11
N$116  (via drill 0.61)
  Top 0.254: v74.29,83.66 74.29,80.48 IC8.12 | v50.16,83.02 50.16,72.22 49.53,71.59 OUT7-8.9
  Bottom 0.254: v74.29,83.66 73.02,83.66 72.38,83.02 64.77,83.02 64.13,82.39 50.8,82.39 v50.16,83.02
N$117
  Bottom 0.254: IC8.2 55.88,70.95 54.61,69.69 50.16,69.69 49.53,70.32 48.26,70.32 46.98,71.59 OUT7-8.10
N$118  (via drill 0.61)
  Top 0.254: v64.13,76.67 64.13,72.86 IC8.5
  Bottom 0.254: v64.13,76.67 57.78,76.67 57.15,76.03 50.16,76.03 49.53,75.4 47.62,75.4 46.98,74.77 46.35,74.77 OUT7-8.12
N$119
  Top 0.254: IC8.6 66.67,72.86 65.4,74.13 65.4,80.48 61.59,84.29 47.62,84.29 47.62,78.58 46.35,77.3 OUT7-8.14
N$120
  Bottom 0.254: IC8.9 73.66,72.22 72.38,73.5 52.7,73.5 52.07,72.86 45.72,72.86 45.08,73.5 45.08,79.21 45.72,79.21 OUT7-8.16
N$121  (via drill 0.61)
  Top 0.254: v73.02,34.76 73.02,44.92 72.38,45.55 72.38,56.98 73.66,58.25 IC7.9 | v43.18,34.76 43.18,39.84 43.81,40.48 43.81,60.8 41.91,62.7 v41.91,69.69
  Bottom 0.254: v43.18,34.76 v73.02,34.76 | v41.91,69.69 41.91,69.05 45.72,69.05 OUT7-8.8
N$122  (via drill 0.61)
  Top 0.254: v47.62,39.84 47.62,48.09 50.16,50.63 50.16,55.71 49.53,56.35 49.53,58.89 47.62,60.8 47.62,62.06 46.98,62.7 45.72,62.7 45.08,63.34 45.08,65.88 45.72,66.51 OUT7-8.6 | v65.4,39.84 65.4,54.45 66.67,55.71 66.67,57.62 IC7.6
  Bottom 0.254: v47.62,39.84 47.62,39.2 60.96,39.2 61.59,39.84 v65.4,39.84
N$123
  Top 0.254: IC7.5 64.13,60.16 65.4,61.43 65.4,67.78 62.86,70.32 62.86,80.48 62.23,81.11 52.7,81.11 52.7,71.59 51.43,70.32 47.62,70.32 47.62,65.88 46.35,64.61 OUT7-8.4
OSEL
  Bottom 0.254: IC10.18 64.77,44.28 67.94,47.46 77.46,47.46 78.1,48.09 78.1,50.63 76.83,50.63 JP1.3
OUT00
  Bottom 0.254: IC1.11 38.1,16.34 34.92,19.52 34.92,26.5 36.83,26.5 37.46,27.14 37.46,30.31 46.98,30.31 48.26,29.04 IC10.1
OUT01
  Bottom 0.254: IC2.11 39.37,27.77 40.64,26.5 49.53,26.5 50.8,27.77 IC10.2
OUT02
  Bottom 0.254: IC3.11 39.37,41.11 59.69,41.11 60.32,40.48 64.77,40.48 65.4,41.11 67.94,41.11 74.29,34.76 74.29,30.31 60.96,30.31 60.32,29.68 60.32,26.5 55.88,26.5 54.61,27.77 IC10.3
OUT03  (via drill 0.61)
  Top 0.254: v50.16,30.95 50.8,31.58 50.8,41.74 50.16,42.38 v50.16,46.82 | v40.64,46.82 38.73,48.73 38.73,52.54 IC4.11
  Bottom 0.254: v50.16,30.95 55.24,30.95 56.51,29.68 IC10.4 | v50.16,46.82 v40.64,46.82
OUT04  (via drill 0.61)
  Top 0.254: v52.7,32.22 52.07,32.85 52.07,41.74 52.7,42.38 v52.7,45.55 | v41.27,45.55 41.91,46.19 41.91,53.17 41.27,53.81 v41.27,62.06
  Bottom 0.254: v52.7,32.22 53.34,31.58 55.88,31.58 57.78,29.68 59.05,29.68 IC10.5 | v52.7,45.55 v41.27,45.55 | v41.27,62.06 38.73,64.61 38.73,65.24 IC5.11
OUT05
  Top 0.254: IC10.6 61.59,27.14 60.32,25.87 60.32,19.52 50.16,9.36 50.16,6.82 49.53,6.18 44.45,6.18 44.45,82.39 43.18,83.66 38.73,83.66 38.73,80.48 IC6.11
OUT06
  Top 0.254: IC10.7 64.77,27.77 67.94,24.6 67.94,6.82 70.48,4.28 75.56,4.28 75.56,63.97 76.83,65.24 IC7.11
OUT07  (via drill 0.61)
  Top 0.254: v67.94,45.55 67.94,29.68 67.3,29.04 IC10.8 | v80,47.46 79.37,48.09 79.37,78.58 v80,79.21
  Bottom 0.254: v67.94,45.55 67.94,46.19 77.46,46.19 78.1,45.55 v80,47.46 | v80,79.21 77.46,79.21 IC8.11
PIA-A0  (via drill 0.61)
  Top 0.254: 93.34,19.52 92.7,20.15 IC12.2 | 93.34,19.52 93.34,12.54 92.07,11.27 92.07,9.36 IC11.2 | 93.34,32.22 92.7,32.85 IC13.2 | 93.34,32.22 93.34,19.52 | 93.34,44.92 92.7,45.55 IC14.2 | 93.34,44.92 93.34,32.22 | 93.34,57.62 92.7,58.25 IC15.2 | 93.34,57.62 93.34,44.92 | 93.34,57.62 93.34,70.32 92.7,70.95 IC16.2 | IC8.3 59.05,70.32 59.05,69.05 57.78,67.78 57.78,60.16 58.41,59.52 IC7.3 58.41,58.25 57.78,57.62 v57.78,52.54 | IC1.3 20.95,9.36 20.95,11.27 22.22,12.54 22.22,16.98 21.58,17.61 21.58,20.15 IC2.3 21.58,21.42 21.58,22.7 22.22,23.33 22.22,29.68 21.58,30.31 21.58,32.85 IC3.3 21.58,34.12 21.58,35.39 22.22,36.03 22.22,42.38 21.58,43.02 21.58,45.55 IC4.3 21.58,46.82 21.58,48.09 22.22,48.73 v22.22,51.27 22.22,55.08 21.58,55.71 21.58,58.25 IC5.3 21.58,59.52 21.58,60.8 22.22,61.43 22.22,67.78 21.58,68.41 21.58,70.95 IC6.3
  Bottom 0.254: v22.22,51.27 45.72,51.27 CORE-IO.1 46.35,51.91 46.98,51.91 47.62,52.54 v57.78,52.54 | IC16.2 92.07,70.32 91.44,69.69 68.57,69.69 67.94,70.32 67.3,69.69 59.69,69.69 59.05,70.32 IC8.3
PIA-A1  (via drill 0.61)
  Top 0.254: IC11.5 99.69,9.36 99.69,11.27 100.96,12.54 100.96,16.98 100.32,17.61 100.32,20.15 IC12.5 100.32,21.42 100.32,22.7 100.96,23.33 100.96,29.68 100.32,30.31 100.32,32.85 IC13.5 100.32,34.12 100.32,35.39 100.96,36.03 100.96,42.38 100.32,43.02 100.32,45.55 IC14.5 100.32,46.82 100.32,48.09 100.96,48.73 v100.96,51.91 100.96,55.08 100.32,55.71 100.32,58.25 IC15.5 100.32,59.52 100.32,60.8 100.96,61.43 100.96,67.78 100.32,68.41 100.32,70.95 IC16.5 | IC8.4 61.59,70.32 61.59,69.05 62.86,67.78 62.86,60.16 62.23,59.52 IC7.4 61.59,57.62 61.59,56.35 v62.86,55.08 | v46.35,59.52 46.35,54.45 CORE-IO.2 | 24.76,19.52 24.12,20.15 IC2.4 | 24.76,19.52 24.76,12.54 23.49,11.27 23.49,9.36 IC1.4 | 24.76,32.22 24.12,32.85 IC3.4 | 24.76,19.52 24.76,32.22 | 24.76,44.92 24.12,45.55 IC4.4 | 24.76,32.22 24.76,44.92 | 24.76,57.62 24.12,58.25 IC5.4 | 24.76,44.92 24.76,57.62 | 24.76,57.62 24.76,70.32 24.12,70.95 IC6.4 | v42.54,44.28 v42.54,53.81
  Bottom 0.254: v46.35,59.52 50.8,59.52 51.43,60.16 52.7,60.16 53.34,60.8 60.96,60.8 61.59,60.16 IC7.4 | v42.54,53.81 45.72,53.81 CORE-IO.2 | v42.54,44.28 24.12,44.28 23.49,44.92 IC4.4 | v100.96,51.91 100.32,51.27 83.81,51.27 79.37,55.71 63.5,55.71 v62.86,55.08
PIA-A2
  Top 0.254: IC1.7 31.11,9.36 32.38,10.63 32.38,17.61 31.11,18.88 31.11,19.52 IC2.7 31.11,22.06 32.38,23.33 32.38,30.31 31.74,30.95 31.74,32.85 IC3.7 31.11,34.76 32.38,36.03 32.38,43.02 31.11,44.28 31.11,44.92 IC4.7 31.11,47.46 32.38,48.73 32.38,55.08 31.74,55.71 31.74,56.98 31.11,57.62 IC5.7 31.11,60.16 32.38,61.43 32.38,68.41 31.11,69.69 31.11,70.32 IC6.7 31.11,72.86 32.38,74.13 32.38,86.19 33.65,87.47 67.94,87.47 67.94,69.05 | 67.94,69.05 67.94,61.43 69.21,60.16 IC7.7 | 67.94,69.05 69.21,70.32 IC8.7 | 103.5,18.25 103.5,14.44 102.23,13.17 102.23,9.36 IC11.6 | 103.5,18.25 102.23,19.52 IC12.6 | 103.5,30.95 102.23,32.22 IC13.6 | 103.5,30.95 103.5,18.25 | 103.5,43.65 102.23,44.92 IC14.6 | 103.5,43.65 103.5,30.95 | 103.5,56.35 102.23,57.62 IC15.6 | 103.5,56.35 103.5,43.65 | 103.5,56.35 103.5,69.05 102.23,70.32 IC16.6
  Bottom 0.254: CORE-IO.3 48.26,51.27 46.98,50 35.55,50 34.92,50.63 34.29,50.63 31.11,47.46 IC4.7 | IC7.7 69.84,58.25 71.11,56.98 100.32,56.98 101.59,58.25 IC15.6
PIA-A3  (via drill 0.61)
  Top 0.254: IC16.9 109.85,70.32 109.85,69.69 110.48,69.05 110.48,68.41 111.12,67.78 111.12,65.24 110.48,64.61 110.48,59.52 IC15.9 110.48,58.25 110.48,55.71 111.12,55.08 111.12,52.54 110.48,51.91 110.48,46.82 IC14.9 109.85,44.92 109.85,44.28 110.48,43.65 110.48,43.02 111.12,42.38 111.12,39.84 110.48,39.2 110.48,34.12 IC13.9 109.85,32.22 109.85,31.58 110.48,30.95 110.48,30.31 111.12,29.68 111.12,27.14 110.48,26.5 110.48,21.42 IC12.9 109.85,19.52 109.85,18.88 110.48,18.25 110.48,17.61 111.12,16.98 111.12,9.36 110.48,8.73 IC11.9 109.21,7.46 106.67,4.92 v104.77,4.92 | IC8.8 72.38,70.95 72.38,68.41 73.02,67.78 73.02,60.16 72.38,59.52 IC7.8 71.75,57.62 71.75,46.19 70.48,44.92 v70.48,37.3 v70.48,5.55 | IC6.8 33.65,70.32 33.65,69.69 34.29,69.05 34.29,68.41 34.92,67.78 34.92,65.24 34.29,64.61 34.29,59.52 IC5.8 34.29,58.25 34.29,55.71 34.92,55.08 v34.92,49.37 34.92,48.73 34.29,48.09 34.29,46.82 IC4.8 33.65,44.92 33.65,44.28 34.29,43.65 34.29,43.02 34.92,42.38 34.92,39.84 34.29,39.2 34.29,37.3 | IC1.8 34.29,8.73 34.29,10.63 34.92,11.27 34.92,16.98 34.29,17.61 34.29,18.25 33.65,18.88 33.65,19.52 IC2.8 34.29,21.42 34.29,26.5 34.92,27.14 34.92,29.68 34.29,30.31 34.29,30.95 33.65,31.58 33.65,32.22 IC3.8 34.29,34.12 34.29,37.3 | v47.62,49.37 47.62,53.17 48.26,53.81 CORE-IO.4 | 34.29,37.3 v34.92,37.3
  Bottom 0.254: v34.92,49.37 v47.62,49.37 | v70.48,37.3 61.59,37.3 60.96,37.94 47.62,37.94 46.35,36.66 35.55,36.66 v34.92,37.3 | v104.77,4.92 104.13,5.55 101.59,5.55 100.96,4.92 100.32,5.55 v70.48,5.55
PIA-A4  (via drill 0.61)
  Top 0.254: IC11.12 109.85,16.98 109.85,17.61 108.58,18.88 108.58,22.06 109.85,23.33 109.85,27.14 IC12.12 109.85,29.68 109.85,30.31 108.58,31.58 108.58,34.76 109.85,36.03 109.85,39.84 IC13.12 109.85,42.38 109.85,43.02 108.58,44.28 108.58,47.46 109.85,48.73 109.85,52.54 IC14.12 109.85,55.08 109.85,55.71 108.58,56.98 108.58,60.16 109.85,61.43 109.85,65.24 IC15.12 109.85,67.78 109.85,68.41 108.58,69.69 | 108.58,69.69 108.58,72.86 109.85,74.13 109.85,77.94 IC16.12 | IC7.13 71.11,67.14 70.48,67.78 70.48,74.13 71.75,75.4 71.75,77.94 IC8.13 71.75,80.48 v71.75,85.56 | IC1.13 33.65,16.98 33.65,17.61 32.38,18.88 32.38,22.06 33.65,23.33 33.65,27.14 IC2.13 33.65,29.68 33.65,30.31 32.38,31.58 32.38,34.76 33.65,36.03 33.65,39.84 IC3.13 33.65,42.38 33.65,43.02 32.38,44.28 32.38,47.46 v33.65,48.73 33.65,52.54 IC4.13 33.65,55.08 33.65,55.71 32.38,56.98 32.38,60.16 33.65,61.43 33.65,65.24 IC5.13 33.65,67.78 33.65,68.41 32.38,69.69 32.38,72.86 33.65,74.13 33.65,77.94 IC6.13 33.65,80.48 v33.65,86.19 | 108.58,69.69 107.31,68.41 106.04,68.41 v106.04,64.61
  Bottom 0.254: v33.65,48.73 34.29,48.09 34.92,48.09 35.55,48.73 46.35,48.73 46.98,48.09 47.62,48.09 48.89,49.37 50.16,49.37 51.43,50.63 CORE-IO.5 | v71.75,85.56 68.57,85.56 67.3,86.83 34.29,86.83 v33.65,86.19 | v106.04,64.61 101.59,64.61 100.96,65.24 100.96,67.78 100.32,68.41 72.38,68.41 71.75,67.78 IC7.13
PIA-A5
  Top 0.254: IC1.14 31.11,16.98 29.84,18.25 29.84,23.33 31.11,24.6 31.11,27.14 IC2.14 31.11,29.68 31.11,30.95 29.84,32.22 29.84,43.65 | 29.84,43.65 31.11,42.38 IC3.14 | 29.84,43.65 29.84,51.27 | 29.84,51.27 31.11,52.54 IC4.14 | 29.84,63.97 31.11,65.24 IC5.14 | 29.84,51.27 29.84,63.97 | 29.84,63.97 29.84,76.67 31.11,77.94 IC6.14 31.11,80.48 31.74,81.11 31.74,86.83 33.02,88.1 69.21,88.1 69.21,80.48 IC8.14 | IC11.15 102.23,16.98 100.96,18.25 100.96,22.06 102.23,23.33 102.23,27.14 IC12.15 102.23,29.68 100.96,30.95 100.96,34.76 102.23,36.03 102.23,39.84 IC13.15 102.23,42.38 100.96,43.65 100.96,47.46 102.23,48.73 102.23,52.54 IC14.15 102.23,55.08 100.96,56.35 100.96,60.16 102.23,61.43 102.23,65.24 IC15.15 102.23,67.78 100.96,69.05 100.96,76.67 102.23,77.94 IC16.15
  Bottom 0.254: CORE-IO.6 50.8,53.81 49.53,55.08 42.54,55.08 39.37,51.91 33.02,51.91 31.74,53.17 IC4.14 | IC8.14 69.84,79.84 71.11,81.11 92.7,81.11 93.34,80.48 93.34,77.94 93.97,77.3 100.32,77.3 101.59,78.58 IC16.15 | IC7.14 69.84,67.14 71.75,69.05 100.96,69.05 102.23,67.78 IC15.15
PIA-A6  (via drill 0.61)
  Top 0.254: IC1.17 23.49,16.98 23.49,17.61 22.22,18.88 22.22,22.06 23.49,23.33 23.49,27.14 IC2.17 23.49,29.68 23.49,30.31 22.22,31.58 22.22,34.76 23.49,36.03 23.49,39.84 IC3.17 23.49,42.38 23.49,43.02 22.22,44.28 22.22,47.46 23.49,48.73 23.49,52.54 IC4.17 23.49,55.08 23.49,55.71 22.22,56.98 22.22,60.16 23.49,61.43 23.49,65.24 IC5.17 23.49,67.78 23.49,68.41 22.22,69.69 22.22,72.86 23.49,74.13 23.49,77.94 IC6.17 | IC8.17 61.59,77.94 61.59,75.4 60.32,74.13 60.32,67.78 60.96,67.14 IC7.17 61.59,65.24 v61.59,62.7 | CORE-IO.7 53.34,51.27 52.7,51.91 52.7,54.45 50.16,56.98 v50.16,62.7 v50.16,67.78 | IC11.16 99.69,16.98 99.69,17.61 98.42,18.88 98.42,22.06 99.69,23.33 99.69,27.14 IC12.16 99.69,29.68 99.69,30.31 98.42,31.58 98.42,34.76 99.69,36.03 99.69,39.84 IC13.16 99.69,42.38 99.69,43.02 98.42,44.28 98.42,47.46 99.69,48.73 99.69,52.54 IC14.16 99.69,55.08 99.69,55.71 98.42,56.98 98.42,60.16 99.69,61.43 99.69,65.24 IC15.16 99.69,67.78 99.69,68.41 98.42,69.69 98.42,72.86 99.69,74.13 99.69,77.94 IC16.16
  Bottom 0.254: v50.16,62.7 v61.59,62.7 62.86,61.43 76.83,61.43 77.46,62.06 85.72,62.06 86.99,63.34 88.26,63.34 88.89,63.97 95.88,63.97 96.52,64.61 99.05,64.61 99.69,65.24 IC15.16 | v50.16,67.78 45.72,67.78 45.08,68.41 24.12,68.41 23.49,67.78 IC5.17
PIA-A7  (via drill 0.61)
  Top 0.254: IC11.19 92.07,16.98 92.07,17.61 90.8,18.88 90.8,22.06 92.07,23.33 92.07,27.14 IC12.19 92.07,29.68 92.07,30.31 90.8,31.58 90.8,34.76 92.07,36.03 92.07,39.84 IC13.19 92.07,42.38 92.07,43.02 90.8,44.28 90.8,47.46 92.07,48.73 92.07,52.54 IC14.19 92.07,55.08 92.07,55.71 90.8,56.98 90.8,60.16 92.07,61.43 92.07,65.24 IC15.19 92.07,67.78 92.07,68.41 90.8,69.69 90.8,72.86 92.07,74.13 92.07,77.94 IC16.19 | v57.78,69.05 57.78,74.13 59.05,75.4 59.05,77.94 IC8.18 | IC1.18 20.95,16.98 20.95,17.61 19.68,18.88 19.68,22.06 20.95,23.33 20.95,27.14 IC2.18 20.95,29.68 20.95,30.31 19.68,31.58 19.68,34.76 20.95,36.03 20.95,39.84 IC3.18 20.95,42.38 20.95,43.02 19.68,44.28 19.68,47.46 20.95,48.73 20.95,52.54 IC4.18 20.95,55.08 20.95,55.71 19.68,56.98 19.68,60.16 20.95,61.43 20.95,65.24 IC5.18 20.95,67.78 20.95,68.41 19.68,69.69 19.68,72.86 20.95,74.13 20.95,77.94 IC6.18 | v60.32,55.08 v60.32,56.35 60.32,61.43 59.05,62.7 59.05,65.24 IC7.18
  Bottom 0.254: v57.78,69.05 59.05,67.78 IC7.18 | 53.97,54.45 52.7,54.45 51.43,55.71 21.58,55.71 20.95,55.08 IC4.18 | 53.97,54.45 CORE-IO.8 53.97,54.45 | v60.32,55.08 54.61,55.08 53.97,54.45 | v60.32,56.35 90.8,56.35 92.07,55.08 IC14.19
PIA-B0  (via drill 0.61)
  Top 0.254: IC10.23 51.43,42.38 51.43,30.95 50.16,29.68 50.16,27.14 51.43,25.87 51.43,24.6 IC9.23 | v60.32,41.74 60.32,46.82 60.96,47.46 60.96,51.27 CORE-IO.13
  Bottom 0.254: v60.32,41.74 52.07,41.74 51.43,42.38 IC10.23
PIA-B1  (via drill 0.61)
  Top 0.254: IC9.22 53.97,24.6 53.97,25.23 52.7,26.5 52.7,29.68 53.97,30.95 53.97,42.38 IC10.22 53.97,44.92 v53.97,49.37 | v62.86,49.37 62.86,51.91 62.23,52.54 62.23,53.81 CORE-IO.14
  Bottom 0.254: v53.97,49.37 v62.86,49.37
PIA-B2  (via drill 0.61)
  Top 0.254: IC10.21 56.51,42.38 56.51,30.95 55.24,29.68 55.24,26.5 56.51,25.23 56.51,24.6 IC9.21 | v64.13,46.19 64.13,50.63 CORE-IO.15
  Bottom 0.254: v64.13,46.19 63.5,45.55 57.15,45.55 56.51,44.92 IC10.21
PIA-B3  (via drill 0.61)
  Top 0.254: IC9.20 59.05,24.6 59.05,25.23 57.78,26.5 57.78,29.68 59.05,30.95 59.05,42.38 IC10.20 59.05,44.92 59.05,46.82 60.32,48.09 v60.32,52.54
  Bottom 0.254: v60.32,52.54 63.5,52.54 64.13,53.17 CORE-IO.16
PIA-B4
  Bottom 0.254: JP1.1 76.83,49.37 75.56,50.63 75.56,51.91 76.19,52.54 77.46,52.54 78.1,53.17 78.1,55.08 68.57,55.08 67.94,54.45 67.94,51.91 66.67,51.91 CORE-IO.17
PIA-B5  (via drill 0.61)
  Top 0.254: v67.94,48.73 67.94,51.91 67.3,52.54 67.3,53.81 CORE-IO.18
  Bottom 0.254: v67.94,48.73 73.66,48.73 JP1.2
PIA-B6
  Bottom 0.254: JP1.5 76.19,53.81 74.92,52.54 71.11,52.54 69.84,51.27 CORE-IO.19
PIA-B7
  Bottom 0.254: JP1.6 73.66,53.81 69.84,53.81 CORE-IO.20
VCC  (via drill 0.61)
  Top 0.508: v86.99,13.17 86.99,15.08 BYP11.1 86.99,16.34 86.99,18.25 88.26,19.52 88.26,23.33 89.53,24.6 89.53,27.14 IC12.20 | v84.45,28.41 v84.45,41.11 v84.45,53.81 | IC15.20 89.53,65.24 89.53,62.7 88.26,61.43 88.26,57.62 86.99,56.35 86.99,54.45 BYP14.1 | v89.53,75.4 89.53,77.94 IC16.20 | IC16.11 112.39,77.94 v112.39,75.4 114.93,72.86 v114.93,66.51 v114.93,53.81 v114.93,41.11 v114.93,28.41 v114.93,15.71 | BYP15.1 86.99,67.14 86.99,72.22 85.72,73.5 85.72,77.3 86.35,77.94 86.99,77.94 86.99,78.58 BYP16.1 | BYP1.1 13.33,16.34 13.33,18.88 14.6,20.15 14.6,22.7 15.87,23.96 15.87,27.14 IC2.20 | IC3.20 15.87,39.84 v15.87,37.3 15.87,36.66 14.6,35.39 14.6,30.95 13.33,29.68 13.33,29.04 BYP2.1 | BYP9.1 46.35,23.96 46.35,31.58 47.62,32.85 v47.62,36.03 47.62,37.94 48.89,39.2 48.89,42.38 IC10.24 48.89,44.92 v48.89,48.09 | IC8.20 53.97,77.94 53.97,74.77 55.24,73.5 55.24,67.78 54.61,67.14 IC7.20 53.97,65.24 53.97,62.06 52.7,60.8 v52.7,55.71 | v59.05,56.35 59.05,54.45 CORE-IO.12 59.05,53.17 59.05,51.91 CORE-IO.11 59.05,50.63 v59.05,48.09 | BYP4.1 13.33,54.45 13.33,55.08 14.6,56.35 14.6,60.8 15.87,62.06 15.87,65.24 IC5.20 15.87,67.78 15.87,68.41 17.14,69.69 17.14,72.86 15.87,74.13 15.87,77.94 IC6.20 | v48.89,10.63 48.89,22.06 IC9.24
  Bottom 0.508: BYP11.1 87.62,15.71 88.89,15.71 IC11.20 | v86.99,13.17 82.55,13.17 BYP17.1 81.27,13.17 76.83,13.17 74.29,10.63 v48.89,10.63 | BYP15.1 87.62,66.51 88.89,66.51 IC15.20 | IC14.20 88.89,53.81 87.62,53.81 BYP14.1 86.35,53.81 v84.45,53.81 | IC12.20 88.89,28.41 87.62,28.41 BYP12.1 86.35,28.41 v84.45,28.41 | IC13.20 88.89,41.11 87.62,41.11 BYP13.1 86.35,41.11 v84.45,41.11 | BYP16.1 87.62,79.21 88.89,79.21 IC16.20 | v89.53,75.4 v112.39,75.4 | v114.93,53.81 113.02,53.81 IC14.11 | v114.93,66.51 113.02,66.51 IC15.11 | v114.93,15.71 113.02,15.71 IC11.11 | v114.93,28.41 113.02,28.41 IC12.11 | v114.93,41.11 113.02,41.11 IC13.11 | BYP3.1 13.97,41.11 15.24,41.11 IC3.20 | BYP1.1 13.97,15.71 15.24,15.71 IC1.20 | BYP2.1 13.97,28.41 15.24,28.41 IC2.20 | BYP9.1 46.98,23.33 48.26,23.33 IC9.24 | IC10.24 48.26,43.65 46.98,43.65 BYP10.1 | BYP7.1 52.07,66.51 53.34,66.51 IC7.20 | BYP8.1 52.07,79.21 53.34,79.21 IC8.20 | BYP6.1 13.97,79.21 15.24,79.21 IC6.20 | BYP5.1 13.97,66.51 15.24,66.51 IC5.20 | BYP4.1 13.97,53.81 15.24,53.81 IC4.20 15.87,55.08 16.5,55.71 20.31,55.71 20.95,56.35 52.7,56.35 | v59.05,56.35 52.7,56.35 | 52.7,56.35 v52.7,55.71 | v48.89,48.09 v59.05,48.09 | v15.87,37.3 16.5,37.94 25.39,37.94 27.3,36.03 v47.62,36.03

## Text on the board
tPlace: I/O Board | +